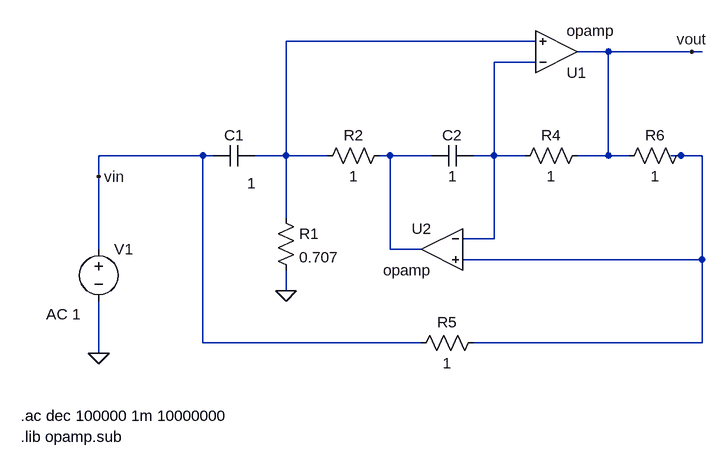
[diagram p0: schematic GIC.asc]
GIC.asc, the LTspice schematic file:
Version 4
SHEET 1 1244 680
WIRE -16 -224 -400 -224
WIRE 96 -208 48 -208
WIRE 224 -208 96 -208
WIRE 240 -208 224 -208
WIRE -16 -192 -80 -192
WIRE -528 -48 -688 -48
WIRE -512 -48 -528 -48
WIRE -400 -48 -400 -224
WIRE -400 -48 -448 -48
WIRE -336 -48 -400 -48
WIRE -240 -48 -256 -48
WIRE -176 -48 -240 -48
WIRE -80 -48 -80 -192
WIRE -80 -48 -112 -48
WIRE -32 -48 -80 -48
WIRE 96 -48 96 -208
WIRE 96 -48 48 -48
WIRE 128 -48 96 -48
WIRE 208 -48 192 -48
WIRE 240 -48 208 -48
WIRE -688 -16 -688 -48
WIRE -400 48 -400 -48
WIRE -80 80 -80 -48
WIRE -80 80 -128 80
WIRE -688 96 -688 -16
WIRE -240 96 -240 -48
WIRE -192 96 -240 96
WIRE 240 112 240 -48
WIRE 240 112 -128 112
WIRE -400 160 -400 128
WIRE -528 240 -528 -48
WIRE -192 240 -528 240
WIRE 240 240 240 112
WIRE 240 240 -112 240
WIRE -688 256 -688 176
FLAG -688 256 0
FLAG -688 -16 vin
FLAG -400 160 0
FLAG 224 -208 vout
SYMBOL voltage -688 80 R0
WINDOW 123 -81 116 Left 2
WINDOW 39 0 0 Left 0
SYMATTR Value2 AC 1
SYMATTR InstName V1
SYMATTR Value ""
SYMBOL OpAmps\\opamp 16 -144 M180
SYMATTR InstName U1
SYMBOL cap -448 -64 R90
WINDOW 0 0 32 VBottom 2
WINDOW 3 43 5 VTop 2
SYMATTR InstName C1
SYMATTR Value 1
SYMATTR SpiceLine Rser=0 Lser=0 Rpar=0 Cpar=0
SYMBOL res -416 32 R0
SYMATTR InstName R1
SYMATTR Value 0.707
SYMBOL res -240 -64 R90
WINDOW 0 0 56 VBottom 2
WINDOW 3 32 56 VTop 2
SYMATTR InstName R2
SYMATTR Value 1
SYMBOL res 64 -64 R90
WINDOW 0 0 56 VBottom 2
WINDOW 3 32 56 VTop 2
SYMATTR InstName R4
SYMATTR Value 1
SYMBOL res -96 224 R90
WINDOW 0 0 56 VBottom 2
WINDOW 3 32 56 VTop 2
SYMATTR InstName R5
SYMATTR Value 1
SYMBOL OpAmps\\opamp -160 32 M0
SYMATTR InstName U2
SYMBOL res 224 -64 R90
WINDOW 0 0 56 VBottom 2
WINDOW 3 32 56 VTop 2
SYMATTR InstName R6
SYMATTR Value 1
SYMBOL cap -112 -64 R90
WINDOW 0 0 32 VBottom 2
WINDOW 3 32 32 VTop 2
SYMATTR InstName C2
SYMATTR Value 1
TEXT -808 384 Left 2 !.lib opamp.sub
TEXT -808 352 Left 2 !.ac dec 100000 1m 10000000

The netlist it stands for:
* GIC.asc
V1 vin 0 AC 1
XU1 N002 N001 vout opamp Aol=100K GBW=10Meg  ; pins invin noninvin out
C1 N001 vin 1 Rser=0 Lser=0 Rpar=0 Cpar=0
R1 N001 0 0.707
R2 N003 N001 1
R4 vout N002 1
R5 N004 vin 1
XU2 N002 N004 N003 opamp Aol=100K GBW=10Meg  ; pins invin noninvin out
R6 N004 vout 1
C2 N002 N003 1
.lib opamp.sub
.ac dec 100000 1m 10000000
.backanno
.end